# EAGLE design sandh (EAGLE 7.7.0)
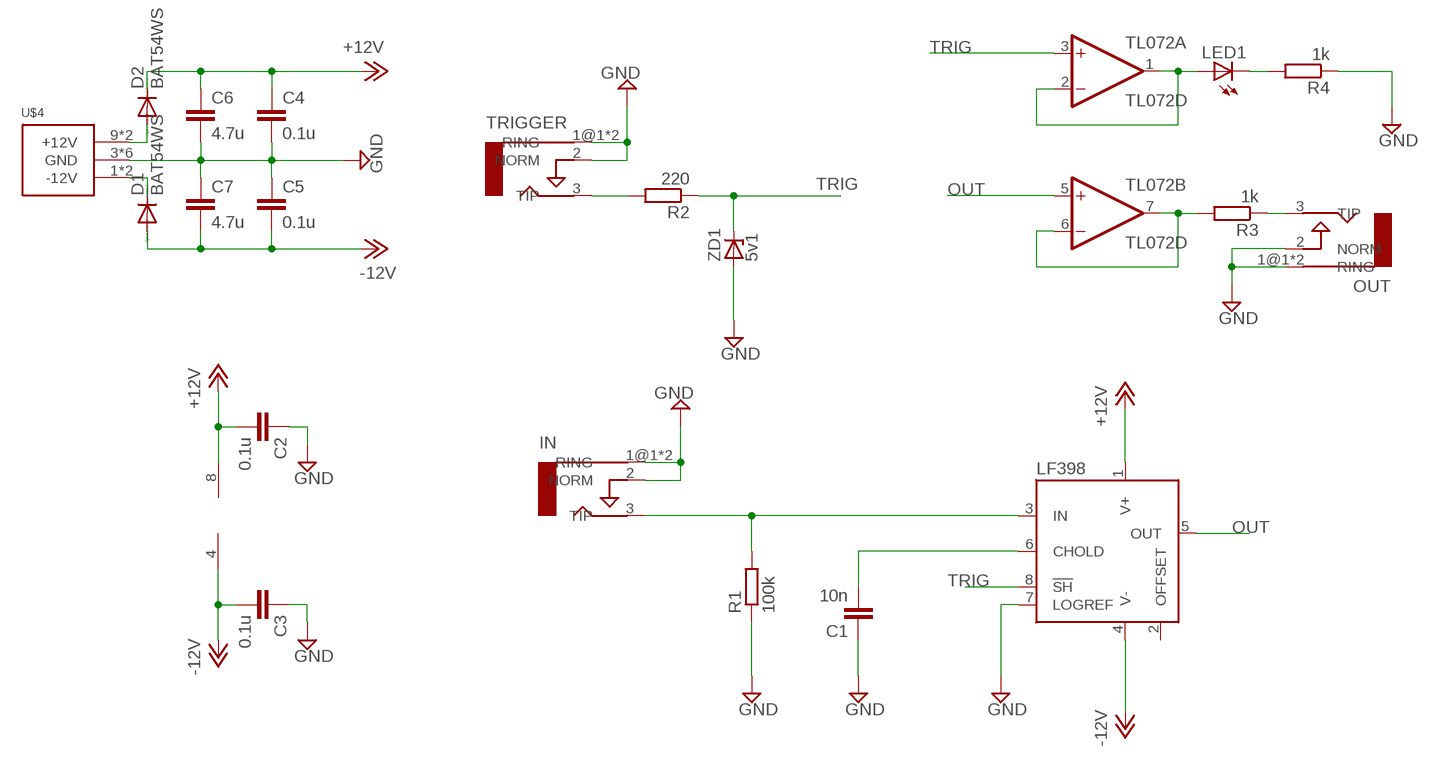
[diagram p0: schematic, sheet 1]

## Parts
C1  10n  C-EUC0805  [C0805]
C2  0.1u  C-EUC0805  [C0805]
C3  0.1u  C-EUC0805  [C0805]
C4  0.1u  C-EUC0805  [C0805]
C5  0.1u  C-EUC0805  [C0805]
C6  4.7u  C-EUC0805  [C0805]
C7  4.7u  C-EUC0805  [C0805]
D1  BAT54WS  DIODE-SOD323-W  [SOD323-W]
D2  BAT54WS  DIODE-SOD323-W  [SOD323-W]
IN  AUDIO-JACKERTHENVAR  [ERTHENVAR-JACK]
LED1  LEDCHIP-LED0805  [CHIP-LED0805]
LF398  LF398AN  [DIL08]
OUT  AUDIO-JACKERTHENVAR  [ERTHENVAR-JACK]
R1  100k  R-EU_R0805  [R0805]
R2  220  R-EU_R0805  [R0805]
R3  1k  R-EU_R0805  [R0805]
R4  1k  R-EU_R0805  [R0805]
TL072  TL072D  [SO08]
TRIGGER  AUDIO-JACKERTHENVAR  [ERTHENVAR-JACK]
U$4  POWER_SIMPLE10  [POWER_10]
ZD1  5v1  ZENER-DIODEZD-2.5  [ZDIO-2.5]

## Nets
+12V: C2.2 C4.1 C6.1 D2.C LF398.1(V+) TL072.8(P:V+)
-12V: C3.2 C5.2 C7.2 D1.A LF398.4(V-) TL072.4(P:V-)
GND: C1.1 C2.1 C3.1 C4.2 C5.1 C6.2 C7.1 IN.1@1(RING) IN.1@2(RING) IN.2(NORM) LF398.7(LOGREF) OUT.1@1(RING) OUT.1@2(RING) OUT.2(NORM) R1.1 R4.1 TRIGGER.1@1(RING) TRIGGER.1@2(RING) TRIGGER.2(NORM) U$4.3(GND) U$4.4(GND) U$4.5(GND) U$4.6(GND) U$4.7(GND) U$4.8(GND) ZD1.A
N$1: IN.3(TIP) LF398.3(IN) R1.2
N$2: C1.2 LF398.6(CHOLD)
N$3: LED1.C R4.2
N$4: R2.2 TRIGGER.3(TIP)
N$5: R3.2 TL072.6(B:-IN) TL072.7(B:OUT)
N$6: D1.C U$4.1(-12V) U$4.2(-12V)
N$7: OUT.3(TIP) R3.1
N$8: D2.A U$4.9(+12V) U$4.10(+12V)
N$9: LED1.A TL072.1(A:OUT) TL072.2(A:-IN)
OUT: LF398.5(OUT) TL072.5(B:+IN)
TRIG: LF398.8(!SH) R2.1 TL072.3(A:+IN) ZD1.C
Unconnected: LF398.2(OFFSET)

## Library data of the parts
C1-C7 = rcl:C-EU: CAPACITOR, European symbol
D1 D2 = diode:DIODE-: DIODE
IN OUT TRIGGER = erthenvar:AUDIO-JACK: Switching Mono 3.5mm Audio Jack from Erthenvar.
LED1 = led:LED: LED OSRAM: - CHIPLED LG R971, LG N971, LY N971, LG Q971, LY Q971, LO R971, LY R971 LH N974, LH R974 LS Q976, LO Q976, LY Q976 LO Q996 - Hyper CHIPLED LW Q18S LB Q993, LB Q99A, LB R99A - SideLED LS A670, LO A670, LY A670, LG A670, LP A670 LB A673, LV A673, LT A673, LW A673 LH A674 LY A675 LS A676, LA A676, LO A676, LY A676, LW A676 LS A679, LY A679, LG A679 - Hyper Micro SIDELED® LS Y876, LA Y876, LO Y876, LY Y876 LT Y87S - SmartLED LW L88C, LW L88S LB L89C, LB L89S, LG L890 LS L89K, LO L89K, LY L89K LS L896, LA L896, LO L896, LY L896 - TOPLED LS T670, LO T670, LY T670, LG T670, LP T670 LSG T670, LSP T670, LSY T670, LOP T670, LYG T670 LG T671, LOG T671, LSG T671 LB T673, LV T673, LT T673, LW T673 LH T674 LS T676, LA T676, LO T676, LY T676, LB T676, LH T676, LSB T676, LW T676 LB T67C, LV T67C, LT T67C, LS T67K, LO T67K, LY T67K, LW E67C LS E67B, LA E67B, LO E67B, LY E67B, LB E67C, LV E67C, LT E67C LW T67C LS T679, LY T679, LG T679 LS T770, LO T770, LY T770, LG T770, LP T770 LB T773, LV T773, LT T773, LW T773 LH T774 LS E675, LA E675, LY E675, LS T675 LS T776, LA T776, LO T776, LY T776, LB T776 LHGB T686 LT T68C, LB T68C - Hyper Mini TOPLED® LB M676 - Mini TOPLED Santana® LG M470 LS M47K, LO M47K, LY M47K Source: http://www.osram.convergy.de LUXEON: - LUMILED® LXK2-PW12-R00, LXK2-PW12-S00, LXK2-PW14-U00, LXK2-PW14-V00 LXK2-PM12-R00, LXK2-PM12-S00, LXK2-PM14-U00 LXK2-PE12-Q00, LXK2-PE12-R00, LXK2-PE12-S00, LXK2-PE14-T00, LXK2-PE14-U00 LXK2-PB12-K00, LXK2-PB12-L00, LXK2-PB12-M00, LXK2-PB14-N00, LXK2-PB14-P00, LXK2-PB14-Q00 LXK2-PR12-L00, LXK2-PR12-M00, LXK2-PR14-Q00, LXK2-PR14-R00 LXK2-PD12-Q00, LXK2-PD12-R00, LXK2-PD12-S00 LXK2-PH12-R00, LXK2-PH12-S00 LXK2-PL12-P00, LXK2-PL12-Q00, LXK2-PL12-R00 Source: www.luxeon.com KINGBRIGHT: KA-3528ASYC Source: www.kingbright.com
LF398 = linear:LF398A: SAMPLE&HOLD AMPLIFIER
R1-R4 = rcl:R-EU_: RESISTOR, European symbol
TL072 = linear:TL072: OP AMP
U$4 = eurorack:POWER_SIMPLE
ZD1 = diode:ZENER-DIODE: Z-Diode

## Board
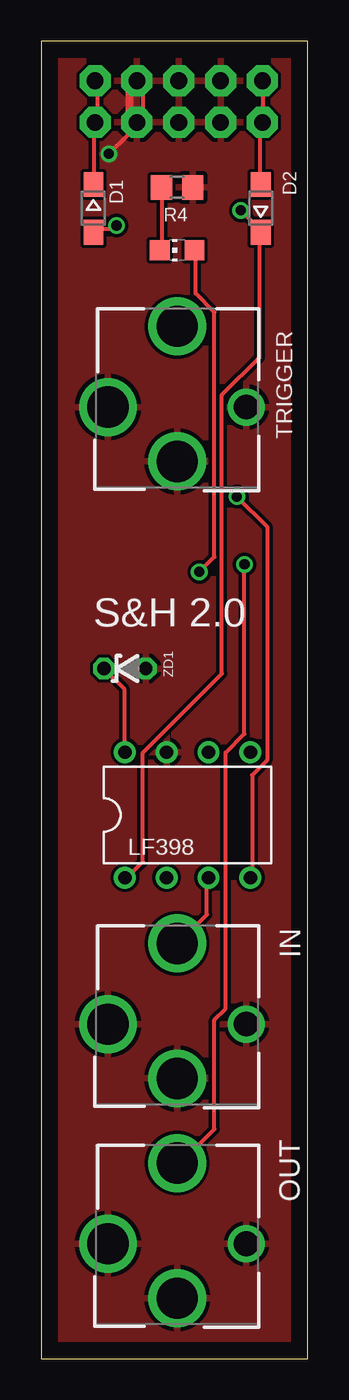
[diagram p1: board, top side]
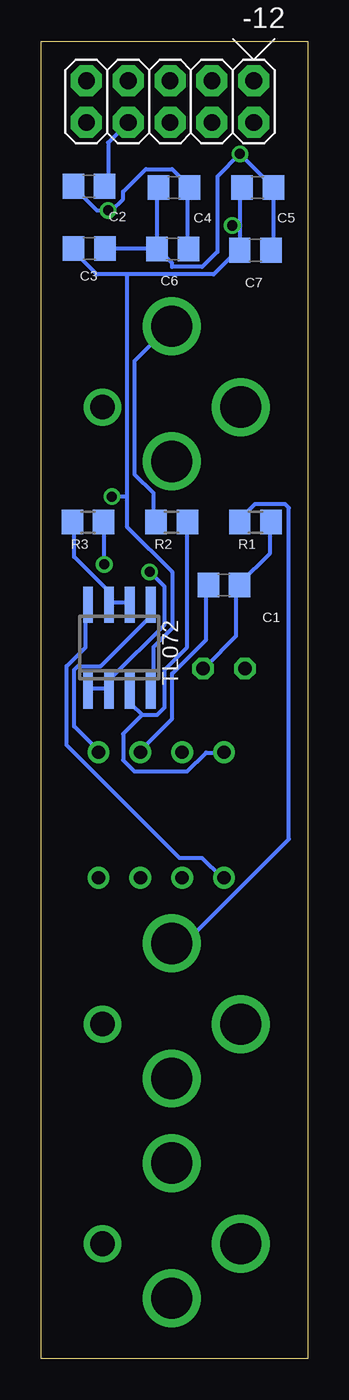
[diagram p2: board, bottom side, seen from below]

Size 16.18 x 80 mm. Coordinates in mm from the lower left corner, seen from the top.
Outline: 0,0 16.18,0 16.18,80 0,80 0,0
Copper layers (1*16): Top 0.035mm / dielectric 1.5mm / Bottom 0.035mm
Design rules "default": minimum track width 10mil, minimum drill 24mil, track to track 8mil, track to pad 8mil, pad to pad 8mil, via to via 8mil, smd to smd 8mil, copper to edge 40mil, drill to drill 8mil, minimum pad ring 10mil, minimum via ring 8mil, stop-mask expansion 4mil, vias tented up to drill 0mil, thermal gap 10mil

### Footprints (pad centres in the part's own frame; a part is rotated, then mirrored left to right if it is on the bottom)
C0805 = smd 1.3 x 1.5: 1 -0.95,0; 2 0.95,0
SOD323-W = smd 1.5 x 1.2: A 1.45,0; C -1.45,0
ERTHENVAR-JACK = drill 2.5: 1@1 -4.2,0; 2 0,-3.3; 3 0,4.9 | drill 1.5: 1@2 4.2,0
CHIP-LED0805 = smd 1.2 x 1.2: A 0,-1.05; C 0,1.05
DIL08 = drill 0.813 pad 1.27: 1 -3.81,-3.81; 2 -1.27,-3.81; 3 1.27,-3.81; 4 3.81,-3.81; 5 3.81,3.81; 6 1.27,3.81; 7 -1.27,3.81; 8 -3.81,3.81
R0805 = smd 1.3 x 1.5: 1 -0.95,0; 2 0.95,0
SO08 = smd 0.6 x 2.2: 1 -1.905,-2.6; 2 -0.635,-2.6; 3 0.635,-2.6; 4 1.905,-2.6; 5 1.905,2.6; 6 0.635,2.6; 7 -0.635,2.6; 8 -1.905,2.6
POWER_10 = drill 1.016 pad 1.88 octagon: 1 -5.08,-1.27; 2 -5.08,1.27; 3 -2.54,-1.27; 4 -2.54,1.27; 5 0,-1.27; 6 0,1.27; 7 2.54,-1.27; 8 2.54,1.27; 9 5.08,-1.27; 10 5.08,1.27
ZDIO-2.5 = drill 0.813 octagon: A 1.27,0; C -1.27,0

### Placement (x,y rotation side)
C1  5.08,46.99 180 bottom
C2  13.27,71.2 180 bottom
C3  13.26,67.42 180 bottom
C4  8.12,71.12 180 bottom
C5  3.04,71.12 180 bottom
C6  8.19,67.39 180 bottom
C7  3.17,67.31 180 bottom
D1  3.17,69.85 270 top
D2  13.34,69.85 90 top
IN  8.26,20.32 0 top
LED1  8.26,67.31 90 top
LF398  8.89,33.02 0 top
OUT  8.26,6.99 0 top
R1  3.17,50.8 180 bottom
R2  8.26,50.8 180 bottom
R3  13.34,50.8 180 bottom
R4  8.26,71.12 180 top
TL072  11.43,43.18 0 bottom
TRIGGER  8.26,57.78 0 top
U$4  8.35,76.33 180 bottom
ZD1  5.08,41.91 0 top

### Tracks (layer width: path | path; a pad name or v marks a point on that pad's centre or on a via)
+12V  (via drill 0.61)
  Top 0.254: v12.12,69.72 13.26,68.58 D2.C 13.26,68.35 13.26,60.81 10.97,58.52 10.97,41.6 6.17,36.8 6.17,30.18 5.26,29.26 LF398.1
  Bottom 0.254: C6.1 7.32,67.44 7.32,71.09 C4.1 7.32,71.32 8.23,72.24 9.83,72.24 11.2,70.87 11.2,70.41 11.89,69.72 v12.12,69.72 12.8,69.72 14.17,71.09 C2.2 | TL072.8 13.49,45.72 13.49,43.2 14.63,42.06 14.63,37.26 7.77,30.4 6.4,30.4 5.26,29.26 LF398.1
-12V  (via drill 0.61)
  Top 0.254: v4.57,68.81 4.34,68.58 3.2,68.58 D1.A | v11.89,52.35 13.72,50.52 13.72,36.35 12.8,35.43 12.8,29.26 LF398.4
  Bottom 0.254: 4.12,68.81 4.12,71.09 C5.2 | 4.12,68.81 4.12,67.44 C7.2 4.34,67.21 5.71,65.84 10.97,65.84 | 4.12,68.81 v4.57,68.81 | 10.97,65.84 12.8,65.84 14.17,67.21 C3.2 | 10.97,65.84 10.97,52.35 | 10.97,52.35 10.97,50.52 8.23,47.78 8.23,44.35 9.37,43.2 9.37,40.69 TL072.4 | 10.97,52.35 v11.89,52.35
GND  (via drill 0.61)
  Top 0.254: v4.12,73.15 5.26,74.3 5.26,77.72 5.71,78.18 5.94,78.18 6.17,77.95 6.17,74.98 5.94,74.75 5.49,74.75 5.49,77.72 5.71,77.95 5.94,77.95 5.94,77.72 U$4.3
  Bottom 0.254: 9.14,67.44 12.12,67.44 C3.1 | 9.14,67.44 9.14,71.09 C4.2 | 9.14,67.44 C6.2 8.91,67.21 8.23,66.52 8.23,66.29 6.4,66.29 5.49,67.21 5.49,71.78 v4.12,73.15 2.29,71.32 C5.1 2.06,71.09 2.06,67.44 C7.1 | R1.1 2.29,50.75 2.29,48.92 4.12,47.09 C1.1 4.34,46.86 4.34,43.89 6.17,42.06 ZD1.A | C2.1 12.12,71.32 12.12,73.84 10.97,74.98 U$4.8
  pour Top: 0,80.01 16.51,80.01 16.51,0 0,0
N$1
  Top 0.254: LF398.3 10.06,29.03 10.06,26.98 8.46,25.38 IN.3
  Bottom 0.254: R1.2 4.12,50.98 3.2,51.89 1.37,51.89 1.14,51.66 1.14,31.55 7.32,25.38 8.23,25.38 IN.3
N$2
  Bottom 0.254: C1.2 6.17,46.86 6.17,43.66 8.23,41.6 8.23,38.86 10.06,37.03 LF398.6
N$3
  Top 0.254: LED1.C 7.32,67.44 7.32,71.09 R4.2
N$4
  Bottom 0.254: R2.2 9.37,50.98 9.37,52.58 10.52,53.72 10.52,60.58 8.46,62.64 TRIGGER.3
N$5
  Bottom 0.254: R3.2 14.17,50.75 14.17,48.69 12.12,46.63 12.12,45.95 TL072.7 11.89,45.95 10.97,45.95 TL072.6
N$6
  Top 0.254: D1.C 3.2,71.32 3.2,74.98 U$4.2 3.43,75.21 3.43,77.5 U$4.1
N$7  (via drill 0.61)
  Top 0.254: v12.34,48.23 12.34,37.95 11.2,36.8 11.2,21.26 10.52,20.57 10.52,13.95 8.46,11.89 OUT.3
  Bottom 0.254: v12.34,48.23 12.34,50.75 R3.1
N$8
  Top 0.254: D2.A 13.26,71.32 13.26,74.98 U$4.10 13.49,75.21 13.49,77.5 U$4.9
N$9  (via drill 0.61)
  Top 0.254: v9.6,47.78 10.52,48.69 10.52,63.55 9.37,64.69 9.37,67.21 LED1.A
  Bottom 0.254: v9.6,47.78 8.69,46.86 8.69,44.58 11.89,41.38 11.89,40.69 TL072.2 12.12,40.69 13.26,40.69 TL072.1
OUT
  Bottom 0.254: TL072.5 9.6,45.72 9.6,45.03 12.57,42.06 13.95,42.06 14.17,41.83 14.17,38.41 12.8,37.03 LF398.5
TRIG
  Top 0.254: ZD1.C 5.03,40.69 5.03,37.03 LF398.8
  Bottom 0.254: 10.06,39.09 9.14,39.09 8.69,39.55 8.69,41.83 7.32,43.2 7.32,50.75 R2.1 | 10.06,39.09 10.74,39.78 10.74,40.46 TL072.3 | 10.06,39.09 11.2,37.95 11.2,36.35 10.52,35.66 7.32,35.66 6.17,36.8 5.26,36.8 LF398.8

### Text on the board
tNames: S&H 2.0